# EAGLE design LightRetaggioSchema_v2 (EAGLE 7.4.0)
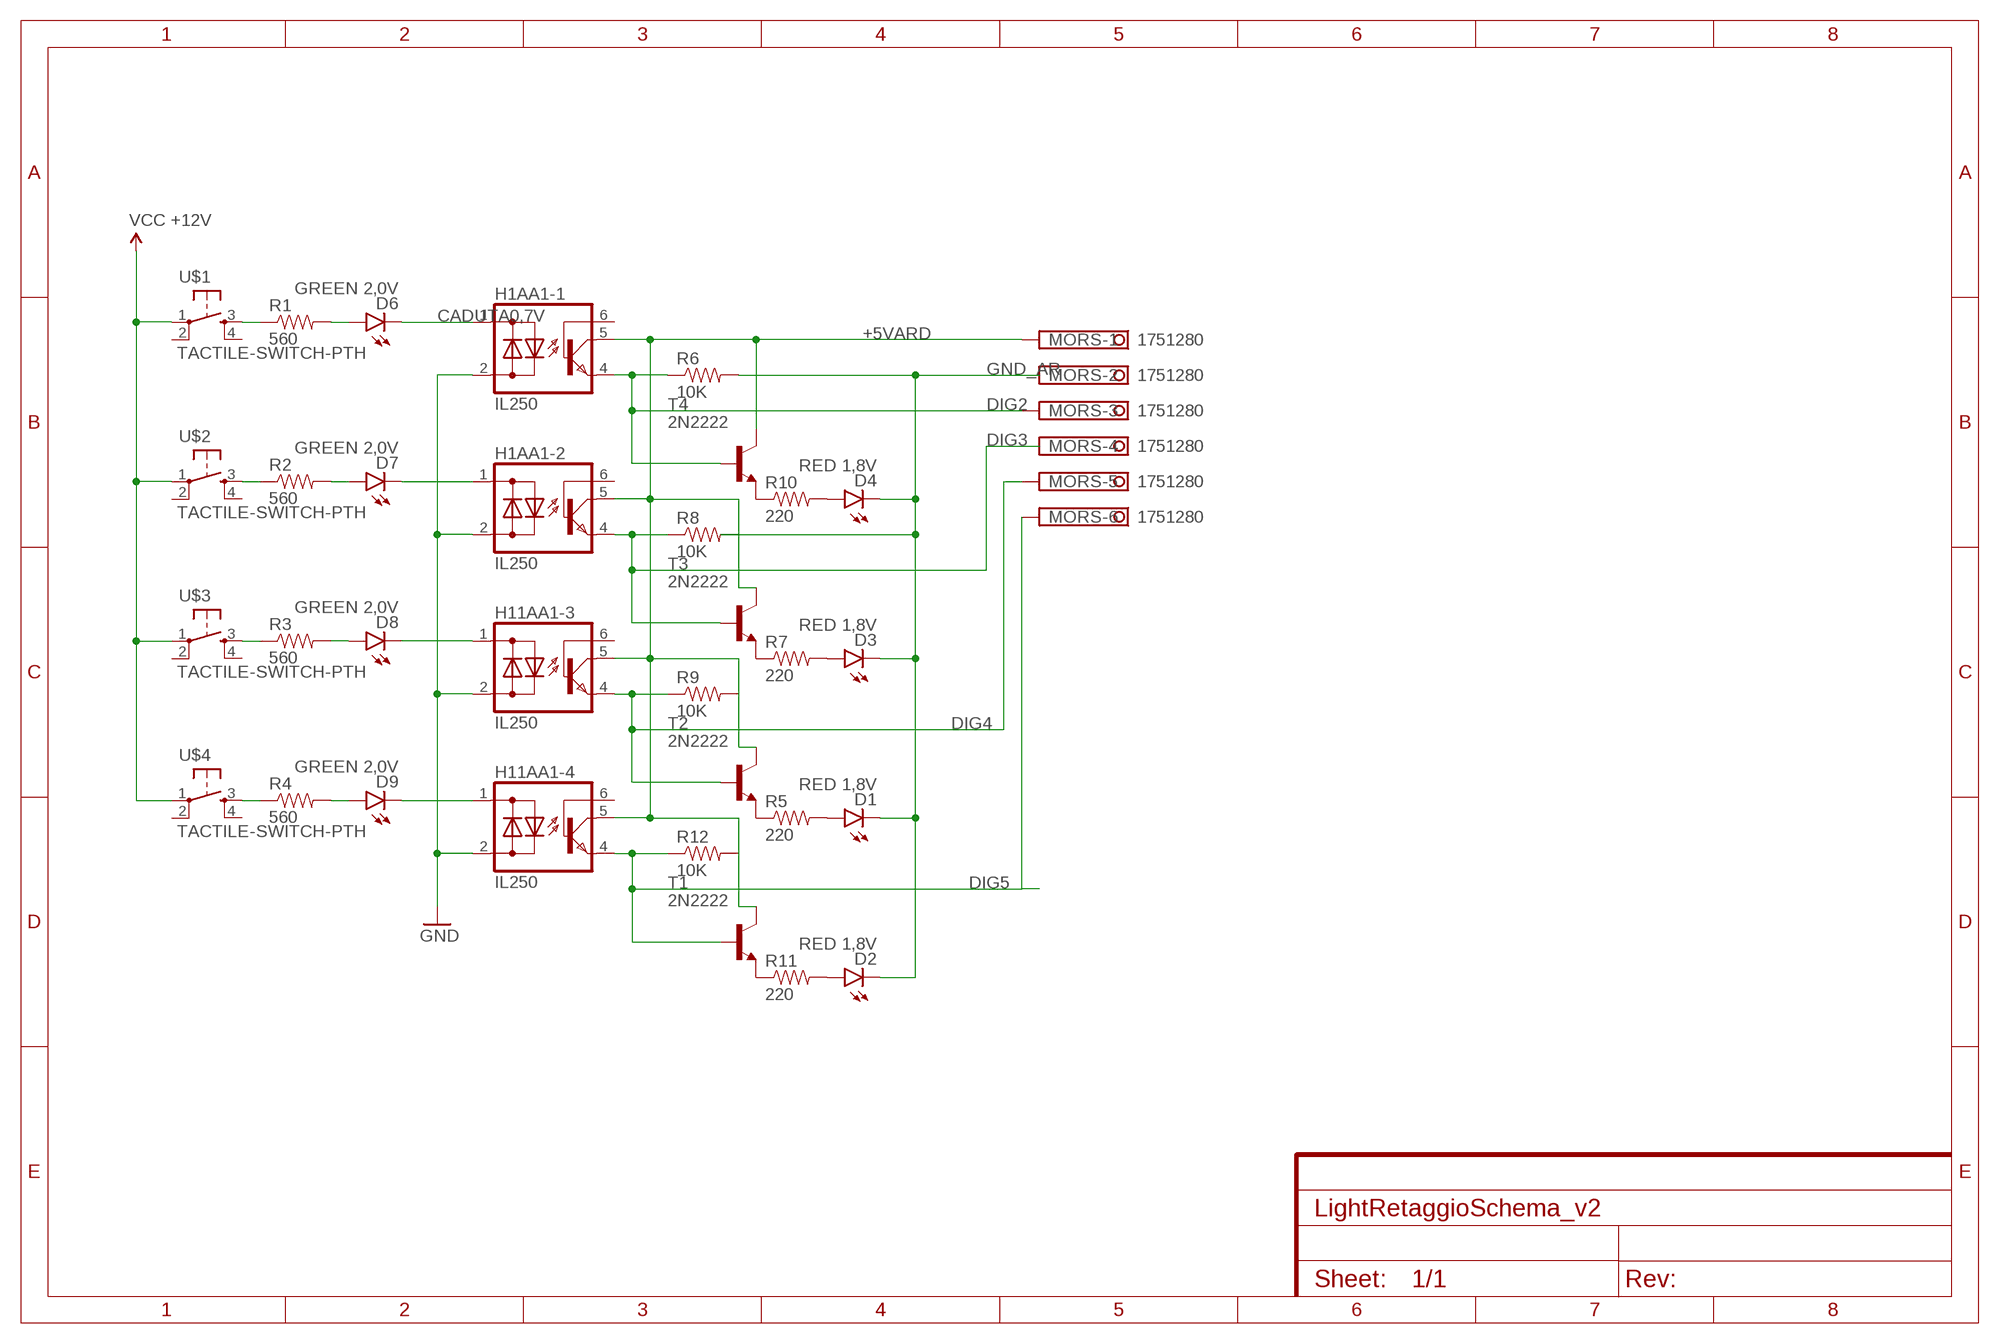
[diagram p0: schematic, sheet 1]

## Parts
D1  RED 1,8V  LED-RED1206  [LED-1206]
D2  RED 1,8V  LED-RED1206  [LED-1206]
D3  RED 1,8V  LED-RED1206  [LED-1206]
D4  RED 1,8V  LED-RED1206  [LED-1206]
D6  GREEN 2,0V  LED-RED1206  [LED-1206]
D7  GREEN 2,0V  LED-RED1206  [LED-1206]
D8  GREEN 2,0V  LED-RED1206  [LED-1206]
D9  GREEN 2,0V  LED-RED1206  [LED-1206]
H1AA1-1  IL250  [DIL06]
H1AA1-2  IL250  [DIL06]
H11AA1-3  IL250  [DIL06]
H11AA1-4  IL250  [DIL06]
MORS  1751280  [1751280]
R1  560  RESISTORPTH-1/4W  [AXIAL-0.4]
R2  560  RESISTORPTH-1/4W  [AXIAL-0.4]
R3  560  RESISTORPTH-1/4W  [AXIAL-0.4]
R4  560  RESISTORPTH-1/4W  [AXIAL-0.4]
R5  220  RESISTORPTH-1/4W  [AXIAL-0.4]
R6  10K  RESISTORPTH-1/4W  [AXIAL-0.4]
R7  220  RESISTORPTH-1/4W  [AXIAL-0.4]
R8  10K  RESISTORPTH-1/4W  [AXIAL-0.4]
R9  10K  RESISTORPTH-1/4W  [AXIAL-0.4]
R10  220  RESISTORPTH-1/4W  [AXIAL-0.4]
R11  220  RESISTORPTH-1/4W  [AXIAL-0.4]
R12  10K  RESISTORPTH-1/4W  [AXIAL-0.4]
T1  2N2222  [TO18]
T2  2N2222  [TO18]
T3  2N2222  [TO18]
T4  2N2222  [TO18]
U$1  TACTILE-SWITCH-PTH  [TAC-SWITCH-PTH]
U$2  TACTILE-SWITCH-PTH  [TAC-SWITCH-PTH]
U$3  TACTILE-SWITCH-PTH  [TAC-SWITCH-PTH]
U$4  TACTILE-SWITCH-PTH  [TAC-SWITCH-PTH]

## Nets
+5VARD: H1AA1-1.5(C) H1AA1-2.5(C) H11AA1-3.5(C) H11AA1-4.5(C) MORS.1 T1.3(C) T2.3(C) T3.3(C) T4.3(C)
CADUTA0,7V: D6.C H1AA1-1.1(AC1)
DIG2: H1AA1-1.4(E) MORS.3 R6.P$1 T4.2(B)
DIG3: H1AA1-2.4(E) R8.P$1 T3.2(B)
DIG4: H11AA1-3.4(E) MORS.5 R9.P$1 T2.2(B)
DIG5: H11AA1-4.4(E) MORS.6 R12.P$1 T1.2(B)
GND: H1AA1-1.2(AC2) H1AA1-2.2(AC2) H11AA1-3.2(AC2) H11AA1-4.2(AC2)
GND_AR: D1.C D2.C D3.C D4.C R6.P$2
N$1: R3.P$1 U$3.3
N$2: R2.P$1 U$2.3
N$3: R4.P$1 U$4.3
N$4: D9.C H11AA1-4.1(AC1)
N$5: D8.C H11AA1-3.1(AC1)
N$6: D7.C H1AA1-2.1(AC1)
N$8: R1.P$1 U$1.3
N$10: R5.P$1 T2.1(E)
N$14: D2.A R11.P$2
N$16: D8.A R3.P$2
N$18: D9.A R4.P$2
N$19: D7.A R2.P$2
N$20: D6.A R1.P$2
N$21: R11.P$1 T1.1(E)
N$22: D1.A R5.P$2
N$23: R7.P$1 T3.1(E)
N$24: D3.A R7.P$2
N$25: R10.P$1 T4.1(E)
N$26: D4.A R10.P$2
VCC: U$1.1 U$2.1 U$3.1 U$4.1 ; supply symbol labelled VCC +12V
Unconnected: H1AA1-1.6(B) H1AA1-2.6(B) H11AA1-3.6(B) H11AA1-4.6(B) MORS.2 MORS.4 R8.P$2 R9.P$2 R12.P$2 U$1.2 U$1.4 U$2.2 U$2.4 U$3.2 U$3.4 U$4.2 U$4.4

## Library data of the parts
D1-D4 D6-D9 = SparkFun-LED:LED-RED: Assorted Red LEDs LilyPad 1206- DIO-09912 1206- DIO-00809 0603- DIO-00819 "SMART" means more efficient and expensive; PROD_ID: DIO-09912; VALUE: RED
H1AA1-1 H1AA1-2 H11AA1-3 H11AA1-4 = optocoupler:IL250: SIEMENS OPTO COUPLER; MF: VISHAY/TELEFUNKEN; MPN: IL250; OC_FARNELL: 1469559; OC_NEWARK: 58K1705
MORS = con-phoenix-350:1751280: MKDS 1/ 6-3,5 Printklemme Nennstrom: 10 A Bemessungsspannung: 160 V Raster: 3,5 mm Polzahl: 6 Montageart: Löten Anschlussart: Schraubanschluss Anschlussrichtung vom Leiter zur Platine: 0° Source: http://eshop.phoenixcontact.com .. 1751280.pdf; MPN: 1751280; OC_FARNELL: unknown; OC_NEWARK: 27R1765
R1-R12 = SparkFun-Passives:RESISTOR: Resistor Basic schematic elements and footprints for 0603, 1206, and PTH resistors.
T1-T4 = transistor:2N2222: NPN TRANSISTOR
U$1-U$4 = GeekAmmo:TACTILE-SWITCH: Tactile Switch 4 Pins, SPST NO

## Board
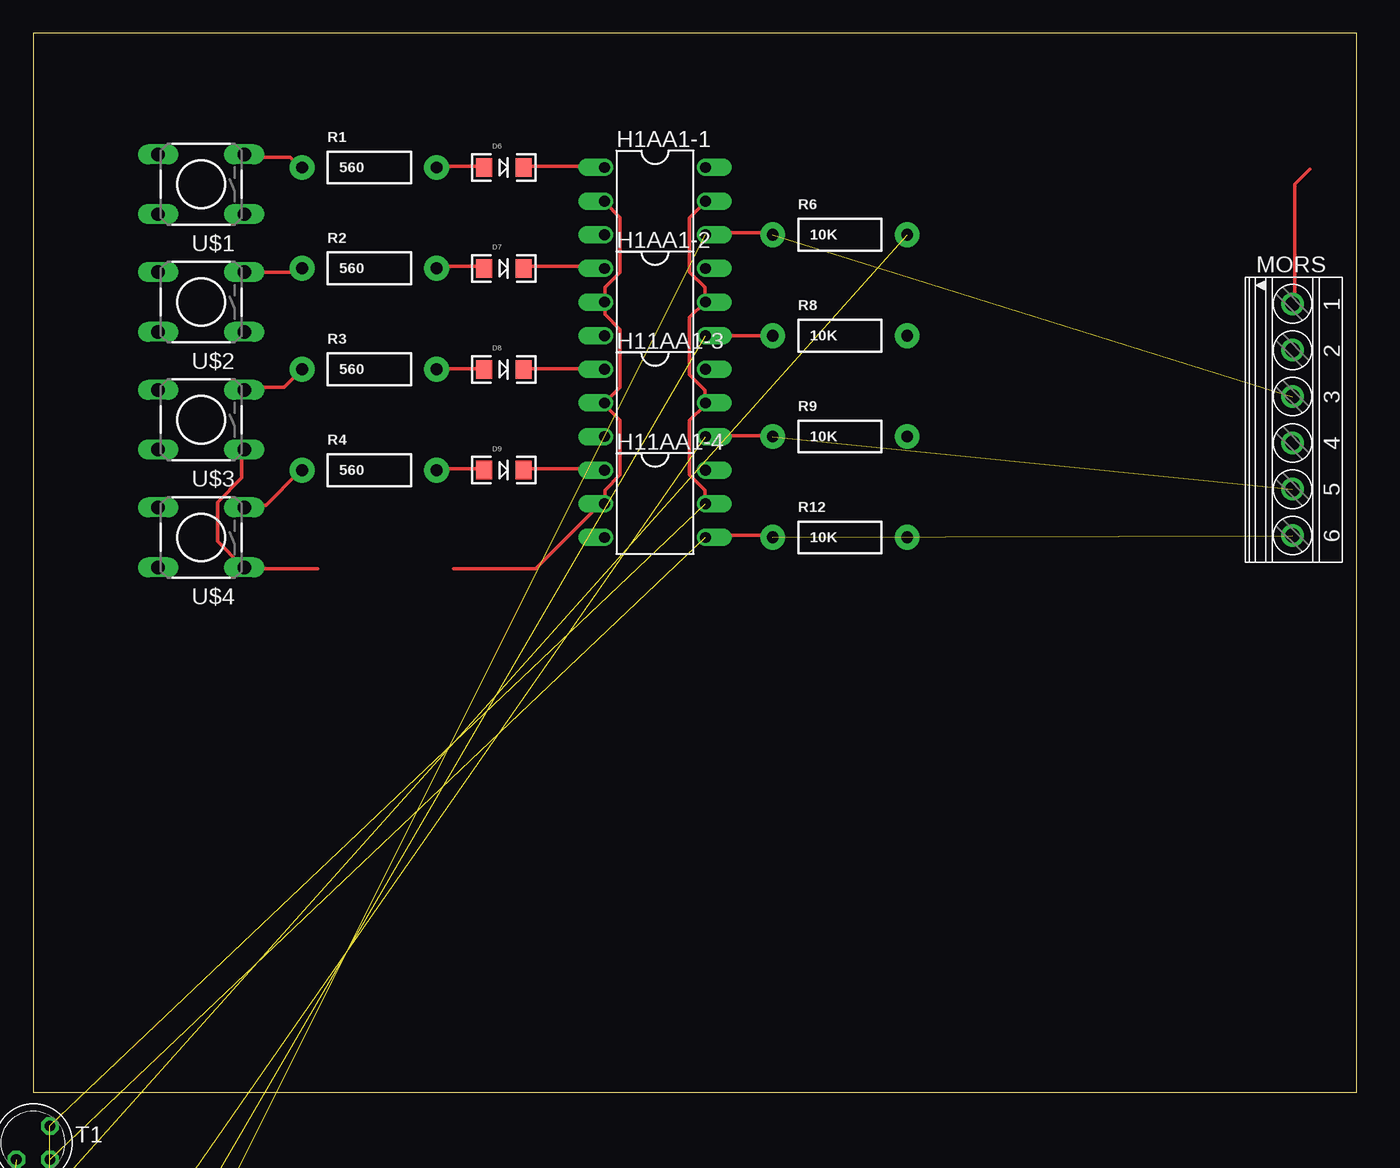
[diagram p1: board, top side]
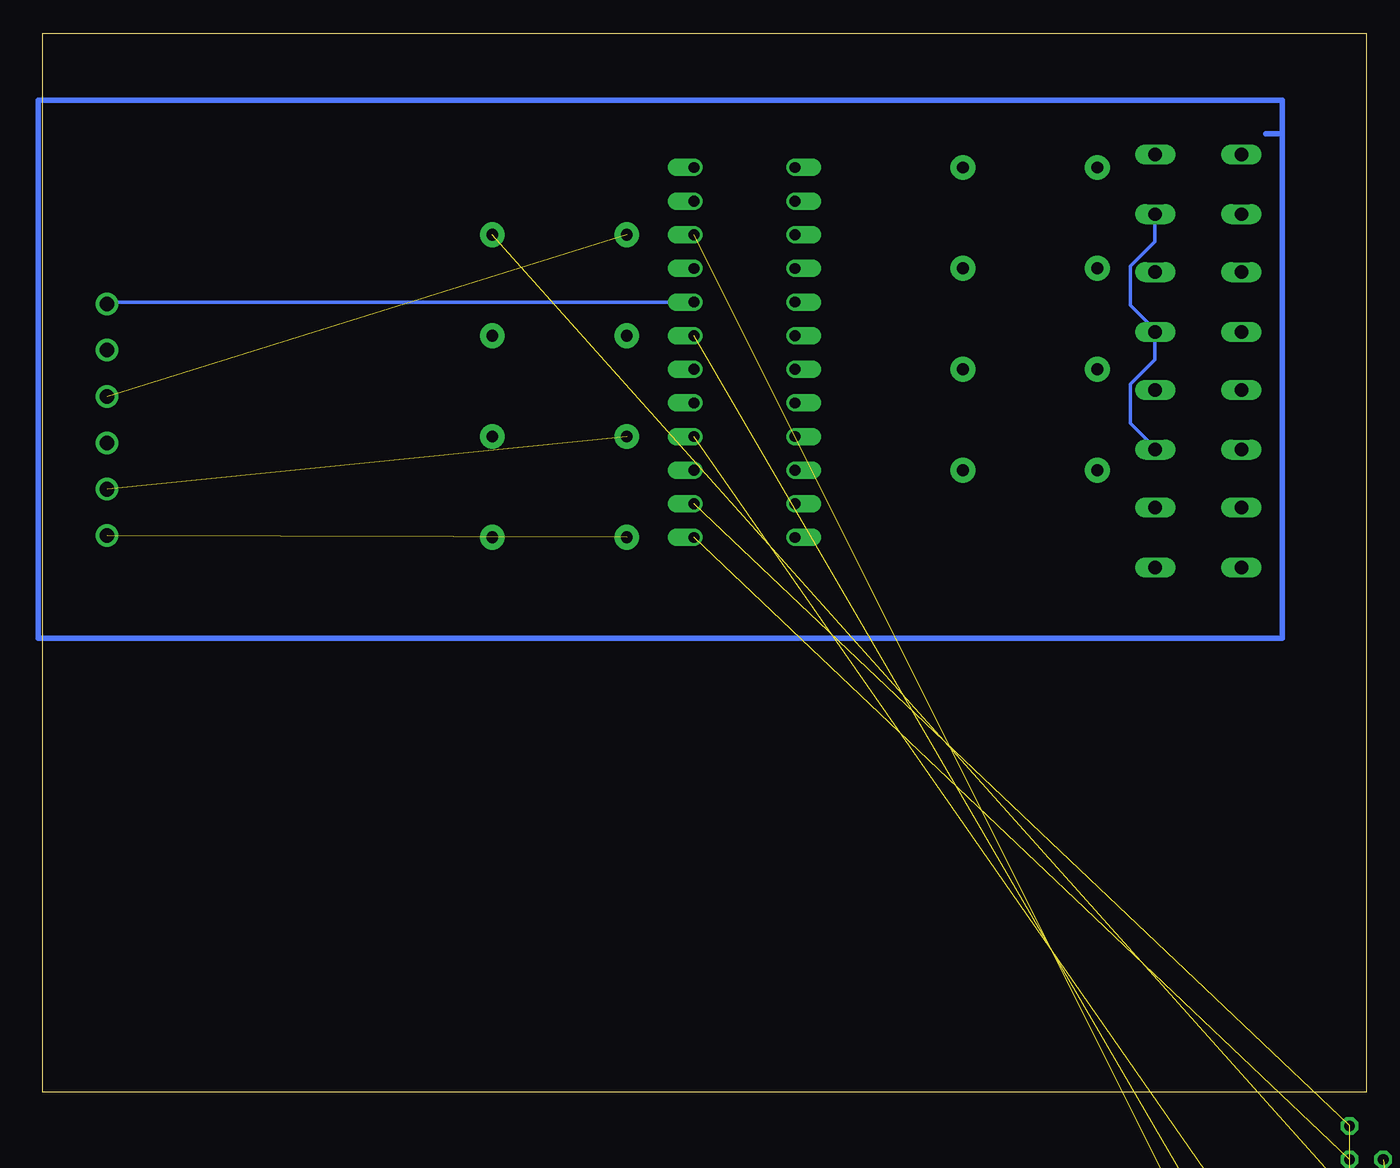
[diagram p2: board, bottom side, seen from below]

Size 100 x 80 mm. Coordinates in mm from the lower left corner, seen from the top.
Outline: 0,0 100,0 100,80 0,80 0,0
Copper layers (1*16): Top 0.035mm / dielectric 1.5mm / Bottom 0.035mm
Design rules "default": minimum track width 10mil, minimum drill 24mil, track to track 8mil, track to pad 8mil, pad to pad 8mil, via to via 8mil, smd to smd 8mil, copper to edge 40mil, drill to drill 8mil, minimum pad ring 10mil, minimum via ring 8mil, stop-mask expansion 4mil, vias tented up to drill 0mil, thermal gap 10mil

### Footprints (pad centres in the part's own frame; a part is rotated, then mirrored left to right if it is on the bottom)
LED-1206 = smd 1.2 x 1.4: A -1.5,0; C 1.5,0
DIL06 = drill 0.813 offset: 1 -2.54,-3.81; 2 0,-3.81; 3 2.54,-3.81; 4 2.54,3.81; 5 0,3.81; 6 -2.54,3.81
1751280 = drill 1.1 pad 1.7: 1 -8.75,-0.1; 2 -5.25,-0.1; 3 -1.75,-0.1; 4 1.75,-0.1; 5 5.25,-0.1; 6 8.75,-0.1
AXIAL-0.4 = drill 0.9 pad 1.88: P$1 -5.08,0; P$2 5.08,0
TO18 = drill 0.813 octagon: 1 -1.27,-1.27; 2 1.27,-1.27; 3 1.27,1.27
TAC-SWITCH-PTH = drill 1.016 pad 1.524 long: 1 -3.251,2.261; 2 3.251,2.261; 3 -3.251,-2.261; 4 3.251,-2.261

### Placement (x,y rotation side)
D1  -1.27,-43.18 0 top  (outside the outline)
D2  -1.27,-8.89 0 top  (outside the outline)
D3  -1.27,-53.34 0 top  (outside the outline)
D4  -1.27,-63.5 0 top  (outside the outline)
D6  35.56,69.85 0 top
D7  35.56,62.23 0 top
D8  35.56,54.61 0 top
D9  35.56,46.99 0 top
H1AA1-1  46.99,67.31 270 top
H1AA1-2  46.99,59.69 270 top
H11AA1-3  46.99,52.07 270 top
H11AA1-4  46.99,44.45 270 top
MORS  95.25,50.8 270 top
R1  25.4,69.85 0 top
R2  25.4,62.23 0 top
R3  25.4,54.61 0 top
R4  25.4,46.99 0 top
R5  2.54,-39.37 0 top  (outside the outline)
R6  60.96,64.77 0 top
R7  2.54,-49.53 0 top  (outside the outline)
R8  60.96,57.15 0 top
R9  60.96,49.53 0 top
R10  2.54,-59.69 0 top  (outside the outline)
R11  2.54,-15.24 0 top  (outside the outline)
R12  60.96,41.91 0 top
T1  0,-3.81 0 top
T2  0,-20.32 0 top  (outside the outline)
T3  0,-26.67 0 top  (outside the outline)
T4  0,-33.02 0 top  (outside the outline)
U$1  12.7,68.58 180 top
U$2  12.7,59.69 180 top
U$3  12.7,50.8 180 top
U$4  12.7,41.91 180 top

### Tracks (layer width: path | path; a pad name or v marks a point on that pad's centre or on a via)
+5VARD  (4 unrouted)
  Top 0.254: 96.47,69.72 95.33,68.58 95.33,59.66 MORS.1 | H11AA1-4.5 50.75,44.58 50.75,45.49 49.61,46.63 49.61,50.75 50.75,51.89 H11AA1-3.5 50.75,52.12 50.75,53.03 49.61,54.18 49.61,58.52 50.75,59.66 H1AA1-2.5 50.75,59.89 50.75,60.81 49.61,61.95 49.61,66.06 50.75,67.21 H1AA1-1.5
  Bottom 0.254: MORS.1 95.1,59.66 50.98,59.66 H1AA1-2.5
CADUTA0,7V
  Top 0.254: D6.C 37.26,69.95 42.98,69.95 H1AA1-1.1
DIG2  (2 unrouted)
  Top 0.254: H1AA1-1.4 50.98,64.92 55.78,64.92 R6.P$1
DIG3  (1 unrouted)
  Top 0.254: R8.P$1 H1AA1-2.4
DIG4  (2 unrouted)
  Top 0.254: H11AA1-3.4 50.98,49.61 55.78,49.61 R9.P$1
DIG5  (2 unrouted)
  Top 0.254: H11AA1-4.4 50.98,42.06 55.78,42.06 R12.P$1
GND
  Top 0.254: H1AA1-1.2 43.2,67.21 44.35,66.06 44.35,61.95 43.2,60.81 43.2,59.89 H1AA1-2.2 43.2,59.66 43.2,58.75 44.35,57.61 44.35,53.26 43.2,52.12 H11AA1-3.2 43.2,51.89 44.35,50.75 44.35,46.63 43.2,45.49 43.2,44.58 H11AA1-4.2 42.98,44.58 37.95,39.55 31.77,39.55
GND_AR  (4 unrouted)
N$1
  Top 0.254: R3.P$1 18.97,53.26 16,53.26 U$3.3
N$2
  Top 0.254: U$2.3 19.89,61.95 20.12,62.18 R2.P$1
N$3
  Top 0.254: U$4.3 16,44.35 17.6,44.35 20.12,46.86 R4.P$1
N$4
  Top 0.254: D9.C 37.26,47.09 42.98,47.09 H11AA1-4.1
N$5
  Top 0.254: D8.C 37.26,54.63 42.98,54.63 H11AA1-3.1
N$6
  Top 0.254: D7.C 37.26,62.41 42.98,62.41 H1AA1-2.1
N$7
  Bottom 0.406: 7.62,72.39 6.35,72.39 | 6.35,72.39 6.35,34.29 100.33,34.29 100.33,74.93 6.35,74.93 6.35,72.39
N$8
  Top 0.254: U$1.3 16,70.64 19.43,70.64 20.12,69.95 R1.P$1
N$10  (1 unrouted)
N$14  (1 unrouted)
N$16
  Top 0.254: D8.A 33.83,54.63 30.63,54.63 R3.P$2
N$18
  Top 0.254: D9.A 33.83,47.09 30.63,47.09 R4.P$2
N$19
  Top 0.254: D7.A 33.83,62.41 30.63,62.41 R2.P$2
N$20
  Top 0.254: D6.A 33.83,69.95 30.63,69.95 R1.P$2
N$21  (1 unrouted)
N$22  (1 unrouted)
N$23  (1 unrouted)
N$24  (1 unrouted)
N$25  (1 unrouted)
N$26  (1 unrouted)
VCC
  Top 0.254: 21.49,39.55 16,39.55 U$4.1 15.77,39.78 13.95,41.6 13.95,44.58 15.77,46.41 15.77,48.46 U$3.1
  Bottom 0.254: U$3.1 16,48.69 17.83,50.52 17.83,53.49 16,55.32 16,57.38 U$2.1 16,57.61 17.83,59.44 17.83,62.41 16,64.24 16,66.29 U$1.1